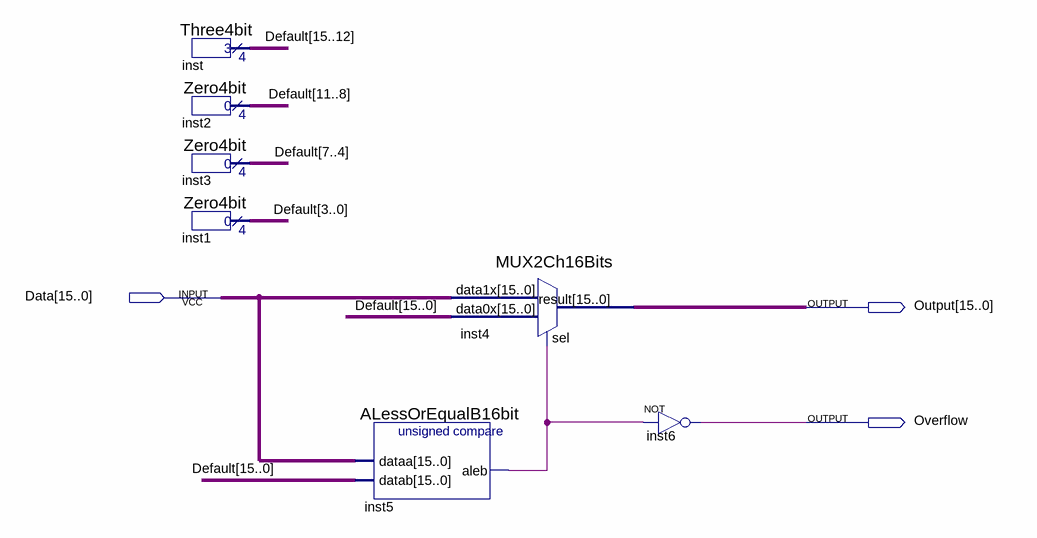
[diagram p0: schematic sheet]
// Quartus schematic TimeValueLimit.bdf as structural Verilog: 7 symbols, 3 pins
module TimeValueLimit (
  input  [15:0] Data,
  output [15:0] Output,
  output Overflow
);

  wire inst5_aleb;
  wire [15:0] Default;

  Three4bit inst (.result(Default[15:12]));
  Zero4bit inst2 (.result(Default[11:8]));
  Zero4bit inst3 (.result(Default[7:4]));
  Zero4bit inst1 (.result(Default[3:0]));
  ALessOrEqualB16bit inst5 (.dataa(Data), .datab(Default), .aleb(inst5_aleb));
  MUX2Ch16Bits inst4 (.data1x(Data), .data0x(Default), .sel(inst5_aleb), .result(Output));
  not inst6 (Overflow, inst5_aleb);
endmodule
